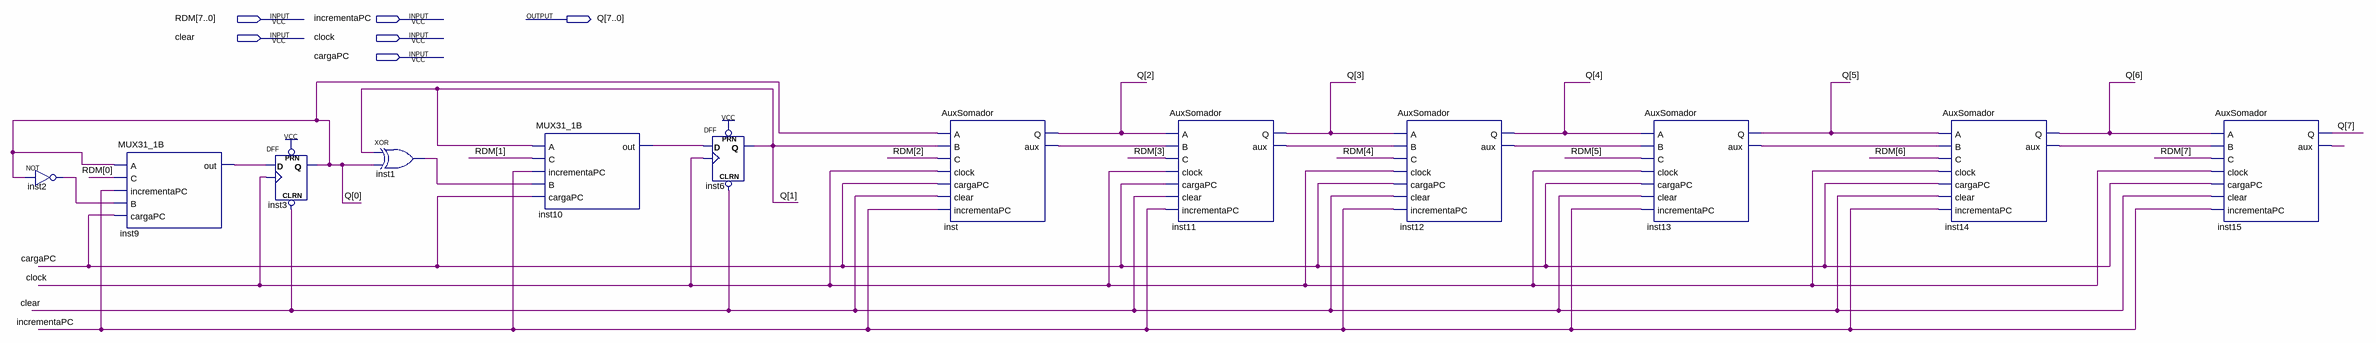
[diagram p0: schematic sheet]
// Quartus schematic PC.bdf as structural Verilog: 12 symbols, 6 pins
module PC (
  input  [7:0] RDM,
  input  incrementaPC,
  input  clear,
  input  clock,
  input  cargaPC,
  output [7:0] Q
);

  wire inst1_out, inst2_out, inst9_out, inst10_out, inst11_aux, inst12_aux, inst13_aux, inst14_aux,
       inst15_aux, inst_aux;

  not inst2 (inst2_out, Q[0]);
  MUX31_1B inst9 (.A(Q[0]), .C(RDM[0]), .incrementaPC(incrementaPC), .B(inst2_out), .cargaPC(cargaPC), .out(inst9_out));
  DFF inst3 (.CLRN(clear), .CLK(clock), .D(inst9_out), .PRN(1'b1), .Q(Q[0]));
  xor inst1 (inst1_out, Q[1], Q[0]);
  MUX31_1B inst10 (
    .A(Q[1]), .C(RDM[1]), .incrementaPC(incrementaPC), .B(inst1_out), .cargaPC(cargaPC), .out(inst10_out));
  DFF inst6 (.CLRN(clear), .CLK(clock), .D(inst10_out), .PRN(1'b1), .Q(Q[1]));
  AuxSomador inst (
    .A(Q[0]), .B(Q[1]), .C(RDM[2]), .clock(clock), .cargaPC(cargaPC), .clear(clear),
    .incrementaPC(incrementaPC), .Q(Q[2]), .aux(inst_aux));
  AuxSomador inst11 (
    .A(Q[2]), .B(inst_aux), .C(RDM[3]), .clock(clock), .cargaPC(cargaPC), .clear(clear),
    .incrementaPC(incrementaPC), .Q(Q[3]), .aux(inst11_aux));
  AuxSomador inst12 (
    .A(Q[3]), .B(inst11_aux), .C(RDM[4]), .clock(clock), .cargaPC(cargaPC), .clear(clear),
    .incrementaPC(incrementaPC), .Q(Q[4]), .aux(inst12_aux));
  AuxSomador inst13 (
    .A(Q[4]), .B(inst12_aux), .C(RDM[5]), .clock(clock), .cargaPC(cargaPC), .clear(clear),
    .incrementaPC(incrementaPC), .Q(Q[5]), .aux(inst13_aux));
  AuxSomador inst14 (
    .A(Q[5]), .B(inst13_aux), .C(RDM[6]), .clock(clock), .cargaPC(cargaPC), .clear(clear),
    .incrementaPC(incrementaPC), .Q(Q[6]), .aux(inst14_aux));
  AuxSomador inst15 (
    .A(Q[6]), .B(inst14_aux), .C(RDM[7]), .clock(clock), .cargaPC(cargaPC), .clear(clear),
    .incrementaPC(incrementaPC), .Q(Q[7]), .aux(inst15_aux));
endmodule
